# Altium schematic sheet MCU.SchDoc
size A; SheetNumber: 2; SheetTotal: 9
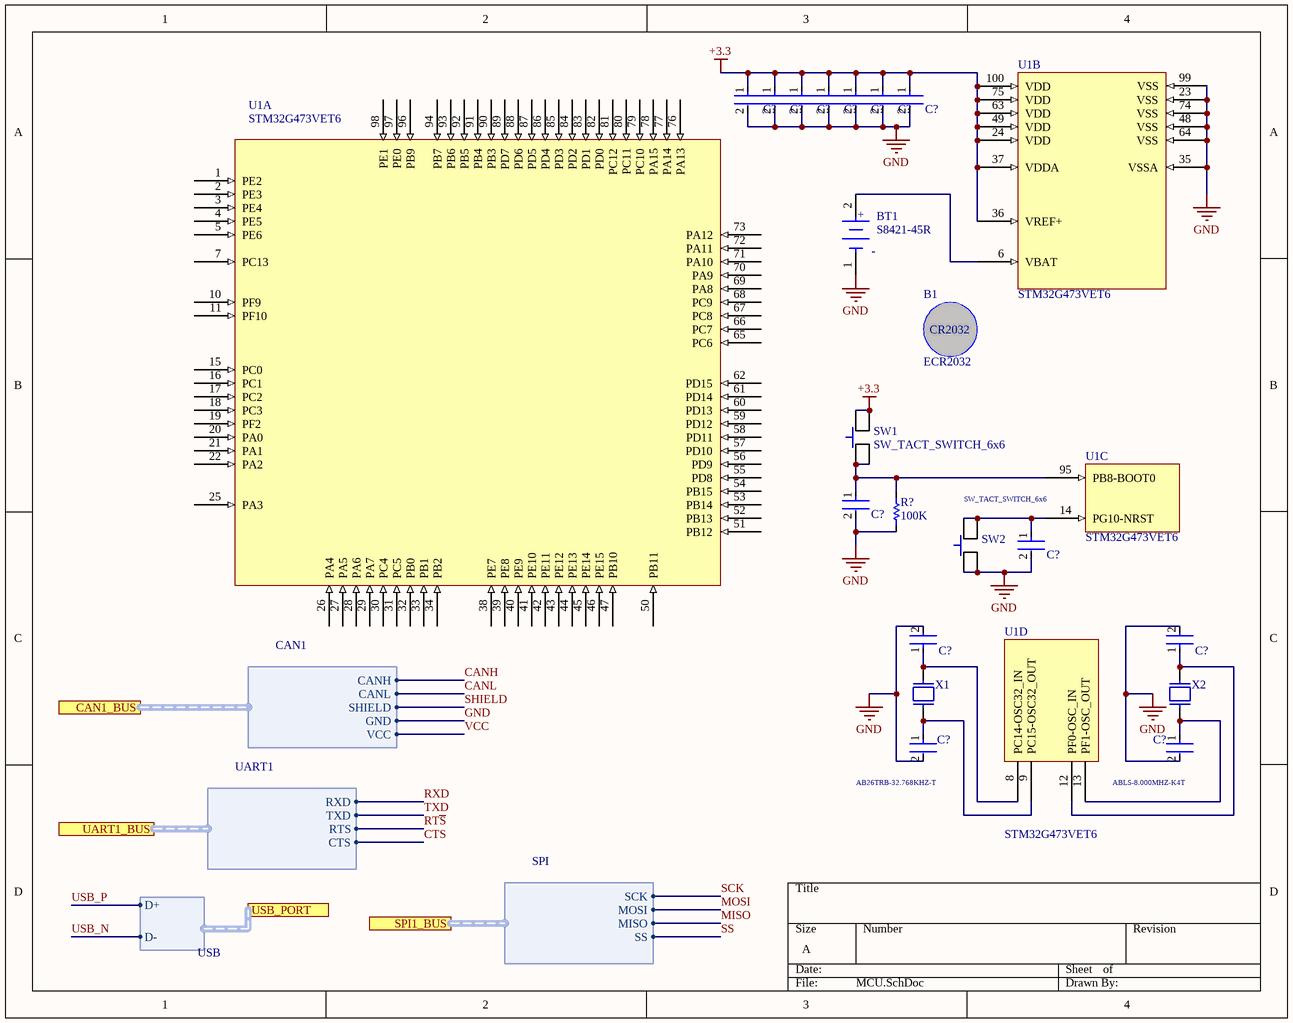
[diagram p0: MCU.SchDoc]

## Parts
(Parts that share a designator on the sheet are numbered #1, #2 ... from top to bottom, then left to right.)
B1  ECR2032
BT1  S8421-45R  [FP-S8421-45R-MFG]
C?#1  C0603C104K5RAC7411  [FP-C0603C-CF-IPC_B]  (value not drawn)
C?#2  C0603C104K5RAC7411  [FP-C0603C-CF-IPC_B]  (value not drawn)
C?#3  C0603C104K5RAC7411  [FP-C0603C-CF-IPC_B]  (value not drawn)
C?#4  C0603C104K5RAC7411  [FP-C0603C-CF-IPC_B]  (value not drawn)
C?#5  C0603C104K5RAC7411  [FP-C0603C-CF-IPC_B]  (value not drawn)
C?#6  C0603C104K5RAC7411  [FP-C0603C-CF-IPC_B]  (value not drawn)
C?#7  C0603C104K5RAC7411  [FP-C0603C-CF-IPC_B]  (value not drawn)
C?#8  C0603C104K5RAC7411  [FP-C0603C-CF-IPC_B]  (value not drawn)
C?#9  C0603C104K5RAC7411  [FP-C0603C-CF-IPC_B]  (value not drawn)
C?#10  C0603C104K5RAC7411  [FP-C0603C-CF-IPC_B]  (value not drawn)
C?#11  C0603C104K5RAC7411  [FP-C0603C-CF-IPC_B]  (value not drawn)
C?#12  C0603C104K5RAC7411  [FP-C0603C-CF-IPC_B]  (value not drawn)
C?#13  C0603C104K5RAC7411  [FP-C0603C-CF-IPC_B]  (value not drawn)
R?  value 100K  [0603_RESISTOR]  (hidden comment: R_0603_100K_1%)
SW1  SW_TACT_SWITCH_6x6  [TACT_SWITCH_6x6_J-LEAD]
SW2  SW_TACT_SWITCH_6x6  [TACT_SWITCH_6x6_J-LEAD]
U1  STM32G473VET6  [TSQFP50P1600X1600X160-100N]  (parts A,B,C,D of 4)
X1  AB26TRB-32.768KHZ-T  [X_2.1mm_RADIAL_CRYSTAL]
X2  ABLS-8.000MHZ-K4T  [ABLS-8.000MHZ-K4T-Footprint-1]

## Ports
CAN1_BUS (harness CAN1), SPI1_BUS (harness SPI), UART1_BUS (harness UART1), USB_PORT (harness USB)

## Harnesses
SPI: SCK, MOSI, MISO, SS
UART1: RXD, TXD, RTS, CTS
CAN1: CANH, CANL, SHIELD, GND, VCC
USB: D+, D-

## Nets
+3.3: C?#1.1 C?#2.1 C?#3.1 C?#4.1 C?#5.1 C?#6.1 C?#7.1 SW1.2 SW1.3 U1.24(VDD) U1.36(VREF+) U1.37(VDDA) U1.49(VDD) U1.63(VDD) U1.75(VDD) U1.100(VDD)
GND: BT1.1(C) C?#1.2 C?#2.2 C?#3.2 C?#4.2 C?#5.2 C?#6.2 C?#7.2 C?#8.2 C?#9.2 C?#10.2 C?#11.2 C?#12.2 C?#13.2 R?.1 SW2.1 SW2.4 U1.23(VSS) U1.35(VSSA) U1.48(VSS) U1.64(VSS) U1.74(VSS) ; port CAN1_BUS.GND
CANH: port CAN1_BUS.CANH
CANL: port CAN1_BUS.CANL
CTS: port UART1_BUS.CTS
MISO: port SPI1_BUS.MISO
MOSI: port SPI1_BUS.MOSI
RT~{S}: port UART1_BUS.RTS
RXD: port UART1_BUS.RXD
SCK: port SPI1_BUS.SCK
SHIELD: port CAN1_BUS.SHIELD
SS: port SPI1_BUS.SS
TXD: port UART1_BUS.TXD
USB_N: port USB_PORT.D-
USB_P: port USB_PORT.D+
VCC: port CAN1_BUS.VCC
NetBT1_2: BT1.2(A) U1.6(VBAT)
NetC?#8_1: C?#8.1 R?.2 SW1.1 SW1.4 U1.95(PB8-BOOT0)
NetC?#9_1: C?#9.1 SW2.2 SW2.3 U1.14(PG10-NRST)
NetC?#10_1: C?#10.1 U1.8(PC14-OSC32_IN) X1.1
NetC?#11_1: C?#11.1 U1.12(PF0-OSC_IN) X2.1
NetC?#12_1: C?#12.1 U1.9(PC15-OSC32_OUT) X1.2
NetC?#13_1: C?#13.1 U1.13(PF1-OSC_OUT) X2.2

Not connected (* = marked no-connect by the designer): U1 1(PE2) 2(PE3) 3(PE4) 4(PE5) 5(PE6) 7(PC13) 10(PF9) 11(PF10) 15(PC0) 16(PC1) 17(PC2) 18(PC3) 19(PF2) 20(PA0) 21(PA1) 22(PA2) 25(PA3) 26(PA4) 27(PA5) 28(PA6) 29(PA7) 30(PC4) 31(PC5) 32(PB0) 33(PB1) 34(PB2) 38(PE7) 39(PE8) 40(PE9) 41(PE10) 42(PE11) 43(PE12) 44(PE13) 45(PE14) 46(PE15) 47(PB10) 50(PB11) 51(PB12) 52(PB13) 53(PB14) 54(PB15) 55(PD8) 56(PD9) 57(PD10) 58(PD11) 59(PD12) 60(PD13) 61(PD14) 62(PD15) 65(PC6) 66(PC7) 67(PC8) 68(PC9) 69(PA8) 70(PA9) 71(PA10) 72(PA11) 73(PA12) 76(PA13) 77(PA14) 78(PA15) 79(PC10) 80(PC11) 81(PC12) 82(PD0) 83(PD1) 84(PD2) 85(PD3) 86(PD4) 87(PD5) 88(PD6) 89(PD7) 90(PB3) 91(PB4) 92(PB5) 93(PB6) 94(PB7) 96(PB9) 97(PE0) 98(PE1) 99(VSS)

## Notes on the sheet
- (in symbol CMP-001-0000-1) +; -
- (in symbol CMP-001-0001-1) CR2032

## Library data of the parts
B1 = CMP-001-0001-1: CR2032 BATTERY LITH 3V COIN 20MM STRIP
BT1 = CMP-001-0000-1: HARWIN - S8421-45R - HOLDER, COIN CELL, CR2032
C?#1-C?#13 = CMP-001-00083-3: Cap Ceramic 0.1uF 50V X7R 10% SMD 0603 125C T/R
R? = CMP-058-000032-1: RES 100K OHM 1/16W 1% 0603 SMD; Manufacturer: TE Connectivity Passive Product; Manufacturer Part Number: CPF0603F100KC1; Power Rating: 0.0625W; SVP Creator: Spencer Berglund; Source: resistor.SchLib; ComponentLink1Description: DigiKey; Design Item ID: R_0603_100K_1%; DigiKey PN: A102199TR-ND; Package: 0603_RESISTOR; ComponentLink1URL: https://www.digikey.com/products/en?keywords=A102199TR-ND
SW1 SW2 = CMP-050-000002-1: SWITCH TACT 6MM BLACK 160GF; SVP Creator: Spencer Berglund; Design Item ID: SW_TACT_SWITCH_6x6; Source: misc.SchLib; Package: 6mm x 6mm
U1 = CMP-00014-4: RISC Microcontroller, 32-Bit, 170MHz; Interface: JTAG; RAM Size: 128; Frequency: 170Hz; Nominal Supply Voltage: 3.3V; Case/Package: LQFP100; RoHS Compliant: Yes; Mounting Technology: SMD; Pins: 100
X1 = CMP-046-000002-2: CRYSTAL 32.7680KHZ 12.5PF SMD; Source: misc.SchLib; Design Item ID: X_32.768kHz_CRYSTAL
X2 = CMP-003-00030-1: ABRACON         ABLS-8.000MHZ-K4T             CRYSTAL, 8MHZ, 18PF, HC-49US